# Altium schematic sheet 3. Proxy.SchDoc: 3. Proxy
size A4; CompanyName: Keri Studio; DrawnBy: Ashish Talaviya; Organization: KERI STUDIO; Address1: ICG COMPOUND; Address2: NR. BHAVANI CIRCLE; Address3: A.K. ROAD; Address4: SURAT-395008; DocumentNumber: 3; Revision: 1.0; SheetNumber: 3; SheetTotal: 4
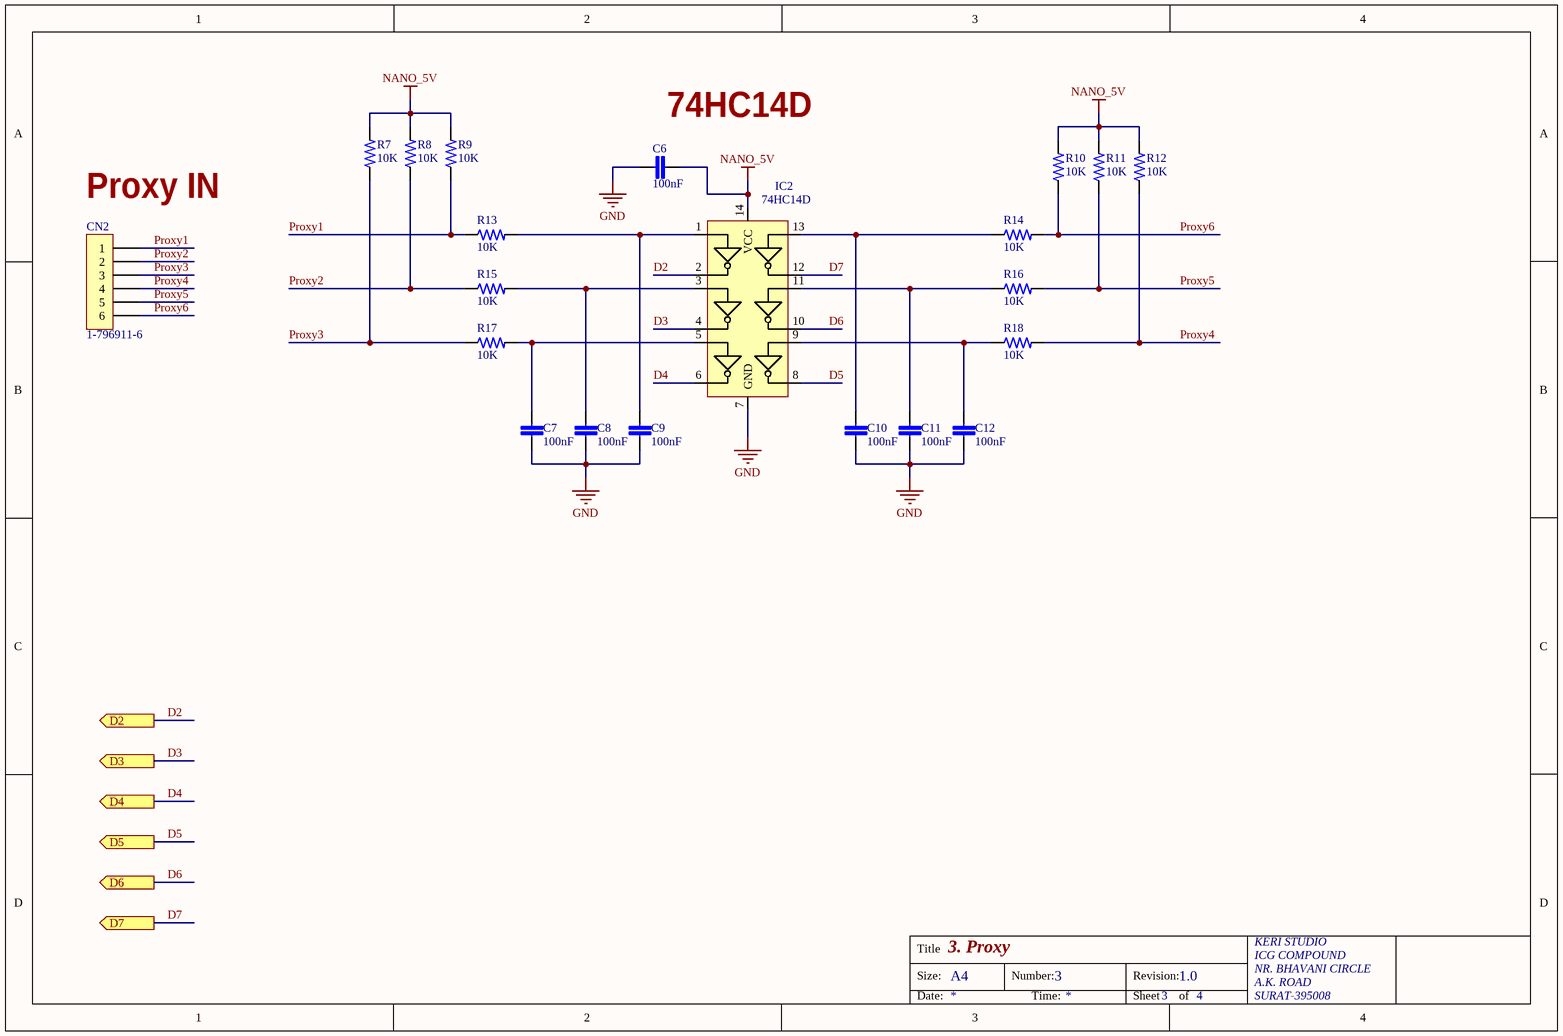
[diagram p0: 3. Proxy.SchDoc]

## Parts
C6  100nF  [C0805]
C7  100nF  [C0805]
C8  100nF  [C0805]
C9  100nF  [C0805]
C10  100nF  [C0805]
C11  100nF  [C0805]
C12  100nF  [C0805]
CN2  1-796911-6  [Terminal_5.08mm_1X06]
IC2  74HC14D  [SOIC-14]
R7  10K  [R0805]
R8  10K  [R0805]
R9  10K  [R0805]
R10  10K  [R0805]
R11  10K  [R0805]
R12  10K  [R0805]
R13  10K  [R0805]
R14  10K  [R0805]
R15  10K  [R0805]
R16  10K  [R0805]
R17  10K  [R0805]
R18  10K  [R0805]

## Ports
D2 (out), D3 (out), D4 (out), D5 (out), D6 (out), D7 (out)

## Nets
GND: C6.2 C7.2 C8.2 C9.2 C10.2 C11.2 C12.2 IC2.7(GND)
NANO_5V: C6.1 IC2.14(VCC) R7.2 R8.2 R9.2 R10.2 R11.2 R12.2
D2: IC2.2(1Y) ; port D2
D3: IC2.4(2Y) ; port D3
D4: IC2.6(3Y) ; port D4
D5: IC2.8(4Y) ; port D5
D6: IC2.10(5Y) ; port D6
D7: IC2.12(6Y) ; port D7
Proxy1: CN2.1 R9.1 R13.1
Proxy2: CN2.2 R8.1 R15.1
Proxy3: CN2.3 R7.1 R17.1
Proxy4: CN2.4 R12.1 R18.2
Proxy5: CN2.5 R11.1 R16.2
Proxy6: CN2.6 R10.1 R14.2
NetC7_1: C7.1 IC2.5(3A) R17.2
NetC8_1: C8.1 IC2.3(2A) R15.2
NetC9_1: C9.1 IC2.1(1A) R13.2
NetC10_1: C10.1 IC2.13(6A) R14.1
NetC11_1: C11.1 IC2.11(5A) R16.1
NetC12_1: C12.1 IC2.9(4A) R18.1

## Notes on the sheet
- (near C6) 74HC14D
- (near CN2) Proxy IN
- Title
- Size:
- A4
- Number:
- Revision:
- Date:
- Time:
- Sheet
- of

## Library data of the parts
C6-C12 = C_0805_0.1uF: Multilayer Ceramic Capacitors MLCC - SMD/SMT 0805 0.1uF 50volts X7R 20%; Manufacturer: Murata; Manufacturer Part Number: GCJ21BR71H104MA01L; Supplier 1: Mouser; Supplier Part Number 1: 81-GCJ21BR71H104MA1L; Stock 1: 0
CN2 = Terminal_5.08mm_1X06: Conn Terminal Block 16 POS 5mm Solder ST Thru-Hole; Manufacturer: TE Connectivity; Plating: Brass; Number of Levels: 1; Number of Positions Per Level: 16; Current: 17.5A; Voltage: 300V; Connector Type: Receptacle; Closed End: Yes (With); Screw Flange: No (Without); Wire Gauge (Max): 30AWG; Wire Gauge (Min): 12AWG; Pitch: 5.08mm; Thread Size: M3; Tail Length: 3.5mm; Supplier 1: Mouser; Manufacturer Part Number: 1-796911-6; Stock 1: 0; Mount: Through Hole; Colour: Green; Contact Plating: Tin; Contact Material: Brass; Housing Material: Polyamide; Housing Colour: Green; Package Quantity: 75; Packaging: Bulk; Termination: Screw; Number of Rows: 1; Interlock: Yes (With); Number of Positions: 16; Screwless Terminal Block: No (Without); Side Stackable: Yes (With); Orientation: Straight; Depth: 9mm; ELV: Compliant; Flammability Rating: UL94 V-0; ComponentLink1URL: https://datasheet.ciiva.com/824/eng-cd-796911-b2-824816.pdf; ComponentLink1Description: https://datasheet.ciiva.com/824/eng-cd-796911-b2-824816.pdf; Supplier Part Number 1: 571-1-796911-6
IC2 = 74HC14D: IC, HEX INVERTER, SCHMITT TRIGGER SOIC14; Manufacturer: NXP Semiconductors; Manufacturer Part Number: 74HC14D,653; Output Current: 25mA; Logic Function: Schmitt Trigger,Buffer,Inverter; Operating Supply Voltage: 5V; High Level Output Current: -5.2mA; Low Level Output Current: 5.2mA; Number of Elements: 6; Number of Inputs: 1; Min Supply Voltage: 2V; Max Supply Voltage: 6V; Propagation Delay: 190ns; Quiescent Current: 2uA; Turn-On Delay Time: 21ns; Supplier 1: Mouser; Stock 1: 0; Mount: Surface Mount; Case/Package: SO; Number of Pins: 14; Weight: 0.009143oz; Contact Plating: Gold; Min Operating Temperature: -40°C; Max Operating Temperature: 125°C; Packaging: Tape and Reel; Package Quantity: 2500; Number of Circuits: 6; Max Supply Voltage (DC): 6V; Min Supply Voltage (DC): 2V; Max Voltage Rating (DC): 6V; Length: 1inch; Height: 0.25inch; Width: 0.5inch; Radiation Hardening: No; REACH SVHC: No SVHC; Lead Free: Lead Free; ComponentLink1URL: https://datasheet.ciiva.com/1163/74hc-hct14-1163056.pdf; ComponentLink1Description: https://datasheet.ciiva.com/1163/74hc-hct14-1163056.pdf; ComponentLink2URL: https://datasheet.ciiva.com/33721/1678760-33721745.pdf; ComponentLink2Description: https://datasheet.ciiva.com/33721/1678760-33721745.pdf; ComponentLink3URL: https://datasheet.ciiva.com/15089/getdatasheetpartid-131068-15089257.pdf; ComponentLink3Description: https://datasheet.ciiva.com/15089/getdatasheetpartid-131068-15089257.pdf; ComponentLink4URL: https://datasheet.ciiva.com/1507/1678760-1507872.pdf; ComponentLink4Description: https://datasheet.ciiva.com/1507/1678760-1507872.pdf; ComponentLink5URL: https://datasheet.ciiva.com/1862/74hc-hct14-1862913.pdf; ComponentLink5Description: https://datasheet.ciiva.com/1862/74hc-hct14-1862913.pdf; ComponentLink6URL: https://datasheet.ciiva.com/1862/74hc-hct14-1862914.pdf; ComponentLink6Description: https://datasheet.ciiva.com/1862/74hc-hct14-1862914.pdf; ComponentLink7URL: https://datasheet.ciiva.com/1862/74hc-hct14-1862915.pdf; ComponentLink7Description: https://datasheet.ciiva.com/1862/74hc-hct14-1862915.pdf; ComponentLink8URL: https://datasheet.ciiva.com/22666/1678760-22666374.pdf; ComponentLink8Description: https://datasheet.ciiva.com/22666/1678760-22666374.pdf; ComponentLink9URL: https://datasheet.ciiva.com/4827/74hc-hct14-4827705.pdf; ComponentLink9Description: https://datasheet.ciiva.com/4827/74hc-hct14-4827705.pdf; ComponentLink10URL: https://datasheet.ciiva.com/36858/1678760-36858062.pdf; ComponentLink10Description: https://datasheet.ciiva.com/36858/1678760-36858062.pdf; Supplier Part Number 1: 771-74HC14D-T
R7-R18 = R_0805_10K: Thick Film Resistors - SMD 10K 0805 5%; Manufacturer: Bourns; Manufacturer Part Number: CR0805-JW-103ELF; Resistance: 10kR; Temperature Coefficient: 200ppm/°C; Power Rating: 125mW; Voltage Rating: 150V; Voltage Rating (DC): 100V; Supplier 1: Mouser; Supplier Part Number 1: 652-CR0805-JW-103ELF; Stock 1: 36802; Pricing 1: 1=0.1, 10=0.03, 50=0.03, 100=0.017, 1000=0.008, 10000=0.006 (USD); Mount: Surface Mount; Case/Package: 0805; Number of Pins: 2; Contact Plating: Tin; Case Code (Metric): 2012; Case Code (Imperial): 0805; Min Operating Temperature: -55°C; Max Operating Temperature: 155°C; Tolerance: 5%; Composition: Thick Film; Package Quantity: 1; Packaging: Tape and Reel; Number of Terminations: 2; Termination: SMD/SMT; Military Standard: Not; Max Power Dissipation: 125mW; Length: 2mm; Height: 0.5mm; Width: 1.25mm; Depth: 1.25mm; Thickness: 508um; Radiation Hardening: No; REACH SVHC: No SVHC; ComponentLink1URL: https://datasheet.ciiva.com/11821/0900766b80fcdb72-11821135.pdf; ComponentLink1Description: https://datasheet.ciiva.com/11821/0900766b80fcdb72-11821135.pdf; ComponentLink2URL: https://datasheet.ciiva.com/9122/chpreztr-9122374.pdf; ComponentLink2Description: https://datasheet.ciiva.com/9122/chpreztr-9122374.pdf; ComponentLink3URL: https://datasheet.ciiva.com/22693/1902866-22693254.pdf; ComponentLink3Description: https://datasheet.ciiva.com/22693/1902866-22693254.pdf; ComponentLink4URL: https://datasheet.ciiva.com/30065/159chpreztr-30065976.pdf; ComponentLink4Description: https://datasheet.ciiva.com/30065/159chpreztr-30065976.pdf; ComponentLink5URL: https://datasheet.ciiva.com/16783/70154685-16783482.pdf; ComponentLink5Description: https://datasheet.ciiva.com/16783/70154685-16783482.pdf; ComponentLink6URL: https://datasheet.ciiva.com/5548/chpreztr-5548491.pdf; ComponentLink6Description: https://datasheet.ciiva.com/5548/chpreztr-5548491.pdf; ComponentLink7URL: https://datasheet.ciiva.com/7986/691949-7986187.pdf; ComponentLink7Description: https://datasheet.ciiva.com/7986/691949-7986187.pdf; ComponentLink8URL: https://datasheet.ciiva.com/6559/chpreztr-6559900.pdf; ComponentLink8Description: https://datasheet.ciiva.com/6559/chpreztr-6559900.pdf; ComponentLink9URL: https://datasheet.ciiva.com/6559/chpreztr-6559901.pdf; ComponentLink9Description: https://datasheet.ciiva.com/6559/chpreztr-6559901.pdf; ComponentLink10URL: https://datasheet.ciiva.com/7985/1856384-7985869.pdf; ComponentLink10Description: https://datasheet.ciiva.com/7985/1856384-7985869.pdf; ComponentLink11URL: https://datasheet.ciiva.com/48692/001055517-da-01-en-smd-wid-cr0805-jw-103elf-10k-ohm-1-8w-48692118.pdf; ComponentLink11Description: https://datasheet.ciiva.com/48692/001055517-da-01-en-smd-wid-cr0805-jw-103elf-10k-ohm-1-8w-48692118.pdf